# Altium schematic sheet Camera_Shield_Camera_Interface.SchDoc: Camera Interface
size B; CompanyName: Cospan Design; DrawnBy: David McCoy; Engineer: David McCoy; Organization: Cospan Design; DocumentNumber: 3; Revision: .revision; SheetNumber: 3; SheetTotal: 4
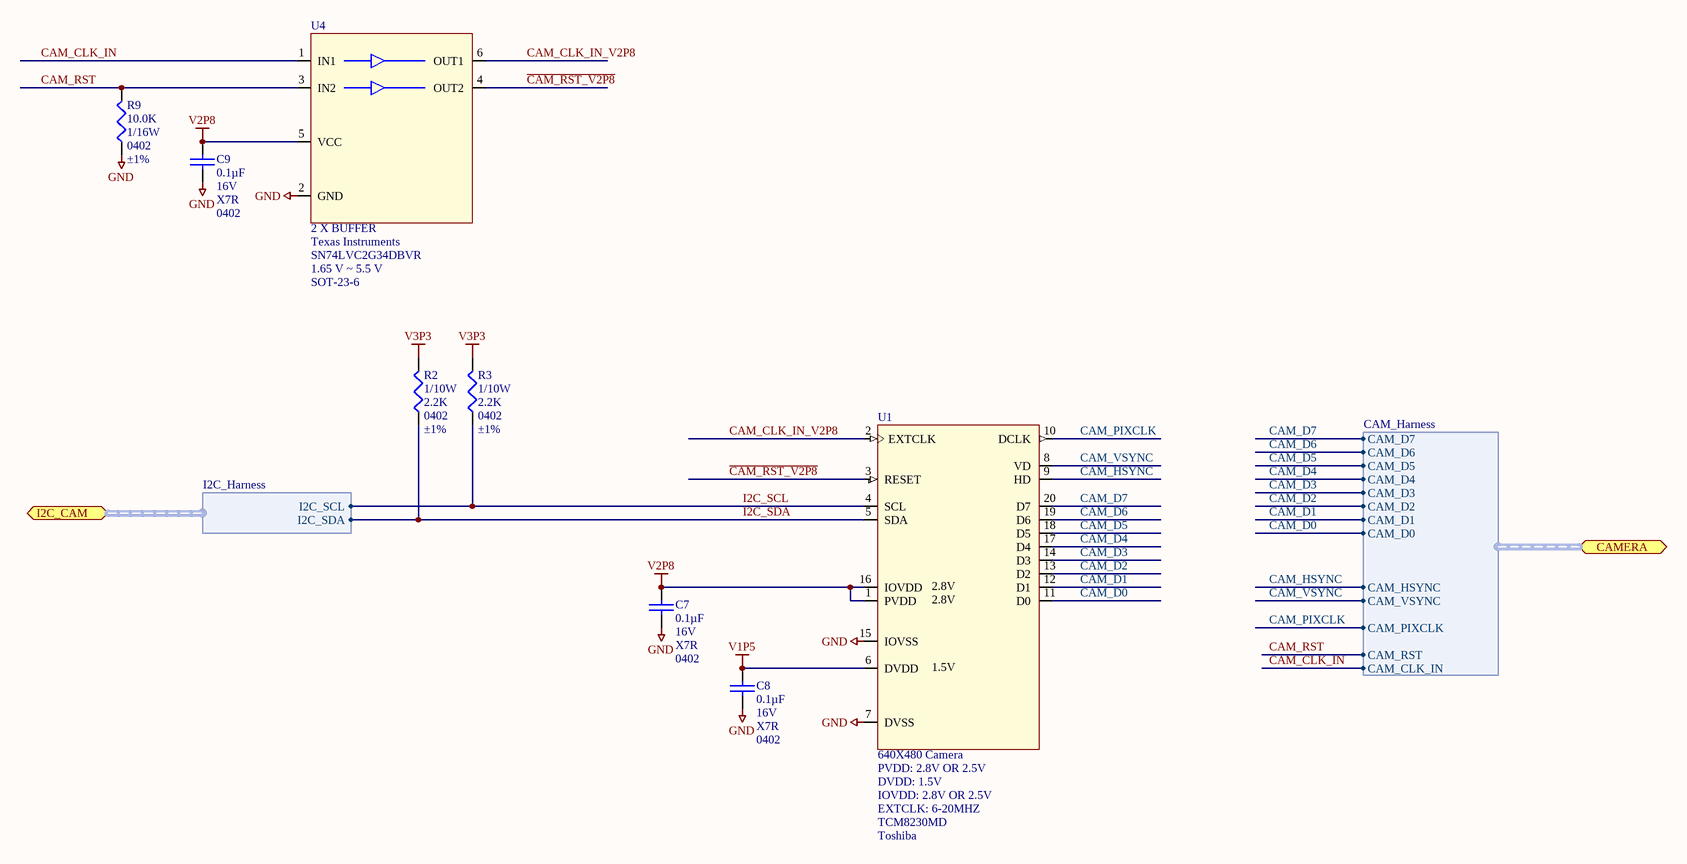
[diagram p0: Camera_Shield_Camera_Interface.SchDoc]

## Parts
C7  Capacitance: 0.1µF  Voltage - Rated: 16V  Temperature Coefficient: X7R  Package / Case: 0402  [C_0402]  (hidden comment: 0.1uF)
C8  Capacitance: 0.1µF  Voltage - Rated: 16V  Temperature Coefficient: X7R  Package / Case: 0402  [C_0402]  (hidden comment: 0.1uF)
C9  Capacitance: 0.1µF  Voltage - Rated: 16V  Temperature Coefficient: X7R  Package / Case: 0402  [C_0402]  (hidden comment: 0.1uF)
R2  Power (Watts): 1/10W  Resistance In Ohms: 2.2K  Case: 0402  Tolerance: ±1%  [ERA-0402]  (hidden comment: 2.2k Ohms)
R3  Power (Watts): 1/10W  Resistance In Ohms: 2.2K  Case: 0402  Tolerance: ±1%  [ERA-0402]  (hidden comment: 2.2k Ohms)
R9  Resistance In Ohms: 10.0K  Power (Watts): 1/16W  Case: 0402  Tolerance: ±1%  [R_0402]  (hidden comment: R_0402_10.0K)
U1  640X480 Camera  PVDD: 2.8V OR 2.5V  DVDD: 1.5V  EXTCLK: 6-20MHZ  Manufacturer: Toshiba  [TCM8230MD]
U4  2 X BUFFER  Manufacturer: Texas Instruments  Manufacturer Part Number: SN74LVC2G34DBVR  Voltage - Supply: 1.65 V ~ 5.5 V  Supplier Device Package: SOT-23-6  [SOT23-6]

## Ports
CAMERA (harness CAM_Harness), I2C_CAM (harness I2C_Harness)

## Harnesses
I2C_Harness: I2C_SDA, I2C_SCL
CAM_Harness: CAM_D7, CAM_D6, CAM_D5, CAM_D4, CAM_D3, CAM_D2, CAM_D1, CAM_D0, CAM_HSYNC, CAM_VSYNC, CAM_PIXCLK, CAM_RST, CAM_CLK_IN

## Nets
GND: C7.1 C8.1 C9.1 R9.2 U1.7(DVSS) U1.15(IOVSS) U4.2(GND)
V1P5: C8.2 U1.6(DVDD)
V2P8: C7.2 C9.2 U1.1(PVDD) U1.16(IOVDD) U4.5(VCC)
V3P3: R2.1 R3.1
~{CAM_RST_V2P8}: U1.3(RESET) U4.4(OUT2)
CAM_CLK_IN: U4.1(IN1) ; port CAMERA.CAM_CLK_IN
CAM_CLK_IN_V2P8: U1.2(EXTCLK) U4.6(OUT1)
CAM_D0: U1.11(D0) ; port CAMERA.CAM_D0
CAM_D1: U1.12(D1) ; port CAMERA.CAM_D1
CAM_D2: U1.13(D2) ; port CAMERA.CAM_D2
CAM_D3: U1.14(D3) ; port CAMERA.CAM_D3
CAM_D4: U1.17(D4) ; port CAMERA.CAM_D4
CAM_D5: U1.18(D5) ; port CAMERA.CAM_D5
CAM_D6: U1.19(D6) ; port CAMERA.CAM_D6
CAM_D7: U1.20(D7) ; port CAMERA.CAM_D7
CAM_HSYNC: U1.9(HD) ; port CAMERA.CAM_HSYNC
CAM_PIXCLK: U1.10(DCLK) ; port CAMERA.CAM_PIXCLK
CAM_RST: R9.1 U4.3(IN2) ; port CAMERA.CAM_RST
CAM_VSYNC: U1.8(VD) ; port CAMERA.CAM_VSYNC
I2C_SCL: R3.2 U1.4(SCL) ; port I2C_CAM.I2C_SCL
I2C_SDA: R2.2 U1.5(SDA) ; port I2C_CAM.I2C_SDA

## Notes on the sheet
- Title:
- http://www.cospandesign.com
- Cospan Design
- Project:
- Document:
- Engineer:
- Drawn By:
- Approved By:
- Revision:
- Date:
- Number:
- of
- (in symbol U_TCM8230MD_CAMERA) 2.8V

## Library data of the parts
C7-C9 = C_0402_0.1UF_16V: CAP CER .10UF 16V X7R 0402; Manufacturer: TDK Corporation; Manufacturer Part Number: C1005X7R1C104K; Tolerance: ±10%; Supplier 1: Digi-Key; Supplier Part Number 1: 445-4952-1-ND; RoHS: RoHS Compliant; Category: Capacitors; Stock 1: 230800; Pricing: 10=0.024, 100=0.0143, 500=0.00826, 1000=0.00572 (USD); Mounting Type: Surface Mount, MLCC; Features: General Purpose; Lead Spacing: -; Thickness: 0.50mm; Packaging: Cut Tape (CT); ComponentLink1URL: http://www.tdk.co.jp/tefe02/e412_c.pdf; ComponentLink1Description: http://www.tdk.co.jp/tefe02/e412_c.pdf; Operating Temperature: -55°C ~ 125°C
  C9: COST_1: *; COST_100: *; COST_1000: *; MANF1: *; MANF1_PN: *; MANF2: *; MANF2_PN: *; MANF3: *; MANF3_PN: *; VENDOR1: *; VENDOR1_PN: *
R2 R3 = R_0402_2.2K: RES 2.20K OHM 1/10W 1% 0402 SMD; Manufacturer: Yageo; Manufacturer Part Number: RC0402FR-072K2L; Temperature Coefficient: ±100ppm/°C; Supplier 1: Digi-Key; Supplier Part Number 1: 311-2.20KLRCT-ND; RoHS: RoHS Compliant; Category: Resistors; Stock 1: 0; Pricing: 10=0.014, 100=0.0063, 500=0.00382, 1000=0.0027, 5000=0.00203 (USD); Resistance (Ohms): 2.2K; Composition: Thick Film; Features: -; Size / Dimension: 0.039" L x 0.020" W (1.00mm x 0.50mm); Height: 0.016" (0.40mm); Packaging: Cut Tape (CT); Package / Case: 0402 (1005 Metric); ComponentLink1URL: http://www.yageo.com/documents/recent/PYu-RC0402_51_RoHS_L_6.pdf; ComponentLink1Description: http://www.yageo.com/documents/recent/PYu-RC0402_51_RoHS_L_6.pdf; Number of Terminations: 2; Supplier 2: Digi-Key; Supplier Part Number 2: RMCF0402FT2K20CT-ND; Stock 2: 39712; ComponentLink2URL: http://www.seielect.com/Catalog/SEI-RMCF_RMCP.pdf; ComponentLink2Description: http://www.seielect.com/Catalog/SEI-RMCF_RMCP.pdf
R9 = R_0402_10.0K: RES 10.0K OHM 1/16W 1% 0402 SMD; Manufacturer: Stackpole Electronics Inc; Manufacturer Part Number: RMCF0402FT10K0; Resistance (Ohms): 10k; Temperature Coefficient: ±100ppm/°C; Supplier 1: Digi-Key; Supplier Part Number 1: RMCF0402FT10K0CT-ND; RoHS: RoHS Compliant; Category: Resistors; Stock 1: 234525; Pricing: 1=0.04, 10=0.025, 50=0.0138, 100=0.0105, 250=0.0078, 500=0.00576, 1000=0.00384, 2500=0.00324, 5000=0.0027 (USD); Composition: Thick Film; Features: -; Package / Case: 0402 (1005 Metric); Size / Dimension: 0.039" L x 0.020" W (1.00mm x 0.50mm); Height: 0.016" (0.40mm); Number of Terminations: 2; Packaging: Cut Tape (CT); ComponentLink1URL: http://www.seielect.com/Catalog/SEI-RMCF_RMCP.pdf; ComponentLink1Description: http://www.seielect.com/Catalog/SEI-RMCF_RMCP.pdf; COST_1: *; COST_100: *; COST_1000: *; MANF1: *; MANF1_PN: *; MANF2: *; MANF2_PN: *; MANF3: *; MANF3_PN: *; VENDOR1: *; VENDOR1_PN: *
U1 = U_TCM8230MD_CAMERA: 640 x 480 SPARKFUN CAMERA; IOVDD: 2.8V OR 2.5V; Manufacturer Part Number: TCM8230MD
U4 = U_SN74LVC2G34DBVR: IC BUFFER DUAL NON-INV SOT23-6; Logic Type: Buffer/Line Driver, Non-Inverting; Number of Bits per Element: 1; Current - Output High, Low: 32mA, 32mA; Number of Elements: 2; Supplier 1: Digi-Key; Supplier Part Number 1: 296-13496-1-ND; RoHS: RoHS Compliant; Category: Integrated Circuits (ICs); Stock 1: 33942; Pricing: 1=0.59, 10=0.494, 25=0.4332, 100=0.3708, 250=0.3216, 500=0.2724, 1000=0.21 (USD); Packaging: Cut Tape (CT); Operating Temperature: -40°C ~ 85°C; Mounting Type: Surface Mount; Package / Case: SOT-23-6; ComponentLink1URL: http://www.ti.com/lit/ds/symlink/sn74lvc2g34.pdf; ComponentLink1Description: http://www.ti.com/lit/ds/symlink/sn74lvc2g34.pdf